# EAGLE design sht75_small_90deg (EAGLE 4.16)
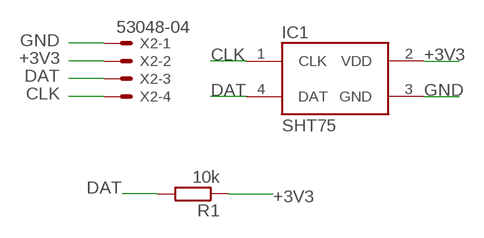
[diagram p0: schematic, sheet 1]

## Parts
IC1  SHT75  [SHT7X]
R1  10k  R-EU_R0603  [R0603]
X2  53048-04  [53048-04]

## Nets
+3V3: IC1.2(VDD) R1.1 X2.2
CLK: IC1.1(CLK) X2.4
DAT: IC1.4(DAT) R1.2 X2.3
GND: IC1.3(GND) X2.1

## Library data of the parts
IC1 = paparazzi_mm:SHT75
R1 = rcl:R-EU_: RESISTOR, European symbol
X2 = con-molex:53?-04: CONNECTOR wire to board 1.25 mm (.049 inch) pitch header

## Board
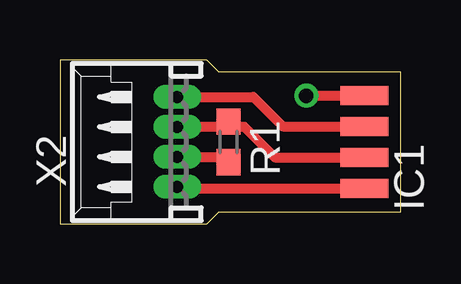
[diagram p1: board, top side]
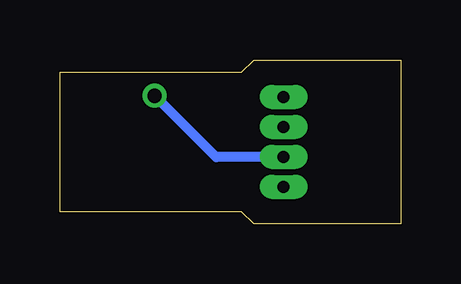
[diagram p2: board, bottom side, seen from below]

Size 14.22 x 6.85 mm. Coordinates in mm from the lower left corner, seen from the top.
Outline: 0,0 6.14,0 6.64,0.5 14.22,0.51 14.22,6.34 6.64,6.35 6.14,6.85 0,6.85 0,0
Copper layers (1*16): Top 0.035mm / dielectric 1.5mm / Bottom 0.035mm
Design rules "default": minimum track width 10mil, minimum drill 24mil, track to track 8mil, track to pad 8mil, pad to pad 8mil, via to via 8mil, smd to smd 8mil, copper to edge 40mil, drill to drill 8mil, minimum pad ring 10mil, minimum via ring 8mil, stop-mask expansion 4mil, vias tented up to drill 0mil, thermal gap 10mil

### Footprints (pad centres in the part's own frame; a part is rotated, then mirrored left to right if it is on the bottom)
SHT7X = smd 0.8 x 2: 1 -1.935,0.04; 2 -0.645,0.04; 3 0.645,0.04; 4 1.935,0.04
R0603 = smd 1.1 x 1: 1 -0.85,0; 2 0.85,0
53048-04 = drill 0.5 pad 0.698 long: 1 1.875,-1.25; 2 0.625,-1.25; 3 -0.625,-1.25; 4 -1.875,-1.25

### Placement (x,y rotation side)
IC1  12.74,3.42 90 top
R1  7.02,3.42 270 top
X2  3.65,3.42 90 top

### Tracks (layer width: path | path; a pad name or v marks a point on that pad's centre or on a via)
+3V3
  Top 0.406: IC1.2 8.96,2.78 7.68,4.06 7.14,4.06 R1.1 6.9,4.15 6.9,4.06 4.99,4.06 | 4.99,4.06 4.98,4.05 | X2.2 4.91,4.06 4.99,4.06
CLK
  Top 0.406: IC1.1 5,1.49 4.92,1.52 X2.4
DAT  (via drill 0.6)
  Top 0.406: R1.2 7.02,2.79 4.91,2.79 X2.3 | IC1.4 v10.27,5.35
  Bottom 0.406: X2.3 4.86,2.79 | X2.3 | v10.27,5.35 7.71,2.79 X2.3
GND
  Top 0.406: X2.1 8.07,5.3 9.3,4.07 IC1.3